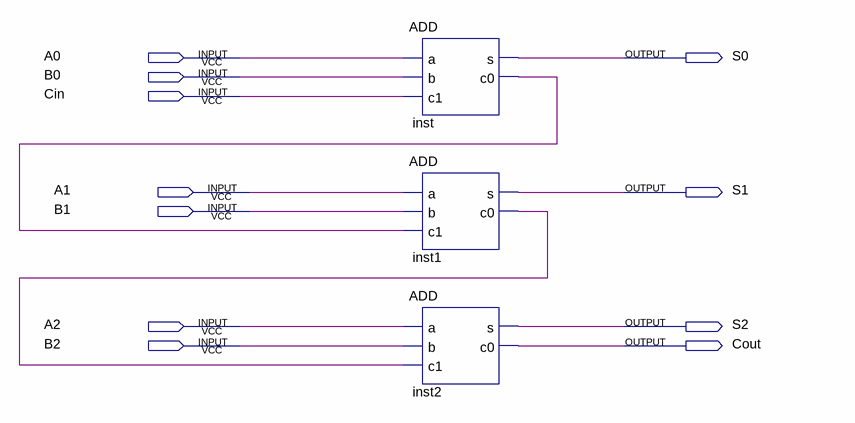
[diagram p0: schematic sheet]
// Quartus schematic TPADD2x3.bdf as structural Verilog: 3 symbols, 11 pins
module TPADD2x3 (
  input  A0,
  input  B0,
  input  Cin,
  input  A1,
  input  B1,
  input  A2,
  input  B2,
  output S0,
  output S1,
  output S2,
  output Cout
);

  wire inst1_c0, inst_c0;

  ADD inst (.a(A0), .b(B0), .c1(Cin), .s(S0), .c0(inst_c0));
  ADD inst1 (.a(A1), .b(B1), .c1(inst_c0), .s(S1), .c0(inst1_c0));
  ADD inst2 (.a(A2), .b(B2), .c1(inst1_c0), .s(S2), .c0(Cout));
endmodule
